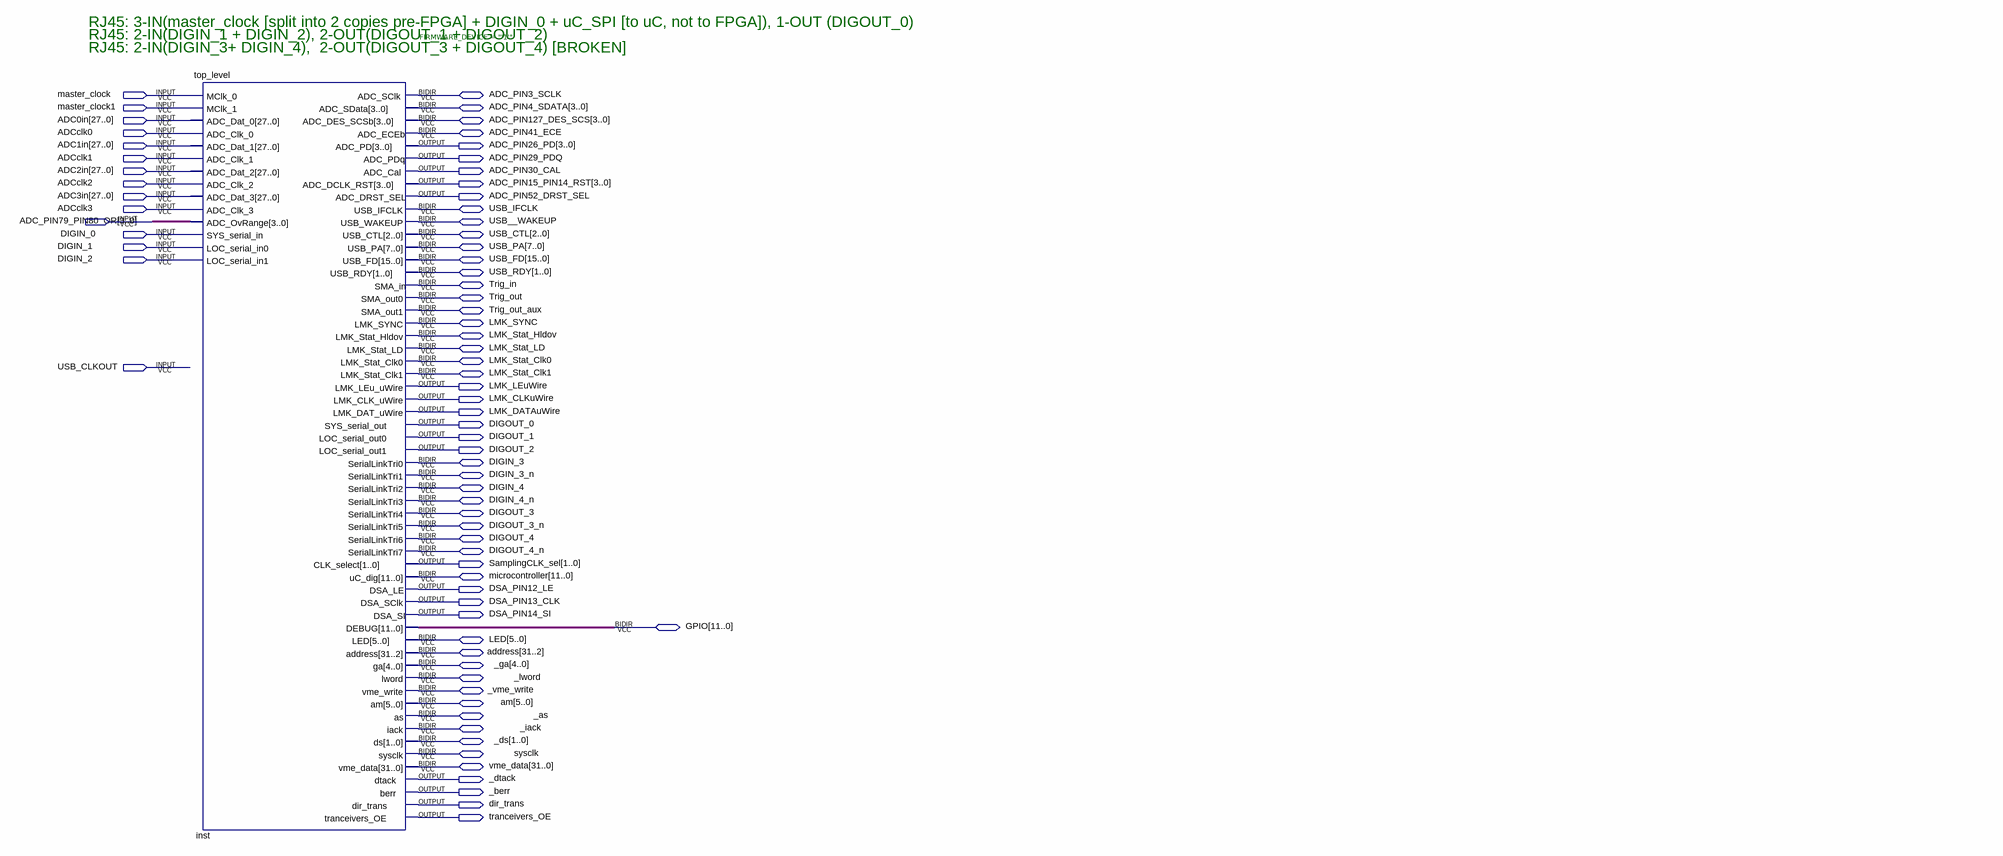
[diagram p0: schematic sheet]
// Quartus schematic phase-array.bdf as structural Verilog: 1 symbols, 73 pins
module \phase-array  (
  input  master_clock,
  input  master_clock1,
  input  [27:0] ADC0in,
  input  ADCclk0,
  input  [27:0] ADC1in,
  input  ADCclk1,
  input  [27:0] ADC2in,
  input  ADCclk2,
  input  [27:0] ADC3in,
  input  ADCclk3,
  input  [3:0] ADC_PIN79_PIN80_OR,
  input  DIGIN_0,
  input  DIGIN_1,
  input  DIGIN_2,
  input  USB_CLKOUT,
  inout  ADC_PIN3_SCLK,
  inout  [3:0] ADC_PIN4_SDATA,
  inout  [3:0] ADC_PIN127_DES_SCS,
  inout  ADC_PIN41_ECE,
  inout  USB_IFCLK,
  inout  USB__WAKEUP,
  inout  [2:0] USB_CTL,
  inout  [7:0] USB_PA,
  inout  [15:0] USB_FD,
  inout  [1:0] USB_RDY,
  inout  Trig_in,
  inout  Trig_out,
  inout  Trig_out_aux,
  inout  LMK_SYNC,
  inout  LMK_Stat_Hldov,
  inout  LMK_Stat_LD,
  inout  LMK_Stat_Clk0,
  inout  LMK_Stat_Clk1,
  inout  DIGIN_3,
  inout  DIGIN_3_n,
  inout  DIGIN_4,
  inout  DIGIN_4_n,
  inout  DIGOUT_3,
  inout  DIGOUT_3_n,
  inout  DIGOUT_4,
  inout  DIGOUT_4_n,
  inout  [11:0] microcontroller,
  inout  [11:0] GPIO,
  inout  [5:0] LED,
  inout  [31:2] address,
  inout  [4:0] _ga,
  inout  _lword,
  inout  _vme_write,
  inout  [5:0] am,
  inout  _as,
  inout  _iack,
  inout  [1:0] _ds,
  inout  sysclk,
  inout  [31:0] vme_data,
  output [3:0] ADC_PIN26_PD,
  output ADC_PIN29_PDQ,
  output ADC_PIN30_CAL,
  output [3:0] ADC_PIN15_PIN14_RST,
  output ADC_PIN52_DRST_SEL,
  output LMK_LEuWire,
  output LMK_CLKuWire,
  output LMK_DATAuWire,
  output DIGOUT_0,
  output DIGOUT_1,
  output DIGOUT_2,
  output [1:0] SamplingCLK_sel,
  output DSA_PIN12_LE,
  output DSA_PIN13_CLK,
  output DSA_PIN14_SI,
  output _dtack,
  output _berr,
  output dir_trans,
  output tranceivers_OE
);

  top_level #(.FIRMWARE_DEVICE("'1'")) inst (
    .MClk_0(master_clock), .MClk_1(master_clock1), .ADC_Dat_0(ADC0in), .ADC_Clk_0(ADCclk0),
    .ADC_Dat_1(ADC1in), .ADC_Clk_1(ADCclk1), .ADC_Dat_2(ADC2in), .ADC_Clk_2(ADCclk2), .ADC_Dat_3(ADC3in),
    .ADC_Clk_3(ADCclk3), .ADC_OvRange(ADC_PIN79_PIN80_OR), .SYS_serial_in(DIGIN_0), .LOC_serial_in0(DIGIN_1),
    .LOC_serial_in1(DIGIN_2), .ADC_SClk(ADC_PIN3_SCLK), .ADC_SData(ADC_PIN4_SDATA),
    .ADC_DES_SCSb(ADC_PIN127_DES_SCS), .ADC_ECEb(ADC_PIN41_ECE), .ADC_PD(ADC_PIN26_PD),
    .ADC_PDq(ADC_PIN29_PDQ), .ADC_Cal(ADC_PIN30_CAL), .ADC_DCLK_RST(ADC_PIN15_PIN14_RST),
    .ADC_DRST_SEL(ADC_PIN52_DRST_SEL), .USB_RDY(USB_RDY), .SYS_serial_out(DIGOUT_0),
    .LOC_serial_out0(DIGOUT_1), .LOC_serial_out1(DIGOUT_2), .CLK_select(SamplingCLK_sel), .LED(LED),
    .dtack(_dtack), .berr(_berr), .dir_trans(dir_trans), .tranceivers_OE(tranceivers_OE),
    .USB_IFCLK(USB_IFCLK), .USB_WAKEUP(USB__WAKEUP), .USB_CTL(USB_CTL), .USB_PA(USB_PA), .USB_FD(USB_FD),
    .SMA_in(Trig_in), .SMA_out0(Trig_out), .SMA_out1(Trig_out_aux), .LMK_SYNC(LMK_SYNC),
    .LMK_Stat_Hldov(LMK_Stat_Hldov), .LMK_Stat_LD(LMK_Stat_LD), .LMK_Stat_Clk0(LMK_Stat_Clk0),
    .LMK_Stat_Clk1(LMK_Stat_Clk1), .LMK_LEu_uWire(LMK_LEuWire), .LMK_CLK_uWire(LMK_CLKuWire),
    .LMK_DAT_uWire(LMK_DATAuWire), .SerialLinkTri0(DIGIN_3), .SerialLinkTri1(DIGIN_3_n),
    .SerialLinkTri2(DIGIN_4), .SerialLinkTri3(DIGIN_4_n), .SerialLinkTri4(DIGOUT_3),
    .SerialLinkTri5(DIGOUT_3_n), .SerialLinkTri6(DIGOUT_4), .SerialLinkTri7(DIGOUT_4_n),
    .uC_dig(microcontroller), .DSA_LE(DSA_PIN12_LE), .DSA_SClk(DSA_PIN13_CLK), .DSA_SI(DSA_PIN14_SI),
    .DEBUG(GPIO), .address(address), .ga(_ga), .lword(_lword), .vme_write(_vme_write), .am(am), .as(_as),
    .iack(_iack), .ds(_ds), .sysclk(sysclk), .vme_data(vme_data));

  // Notes on the sheet:
  //   RJ45: 3-IN(master_clock [split into 2 copies pre-FPGA] + DIGIN_0 + uC_SPI [to uC, not to FPGA]), 1-OUT (DIGOUT_0)
  //   RJ45: 2-IN(DIGIN_1 + DIGIN_2), 2-OUT(DIGOUT_1 + DIGOUT_2)
  //   RJ45: 2-IN(DIGIN_3+ DIGIN_4),  2-OUT(DIGOUT_3 + DIGOUT_4) [BROKEN]
endmodule
